# EAGLE design LM339rev3 (EAGLE 9.6.2)
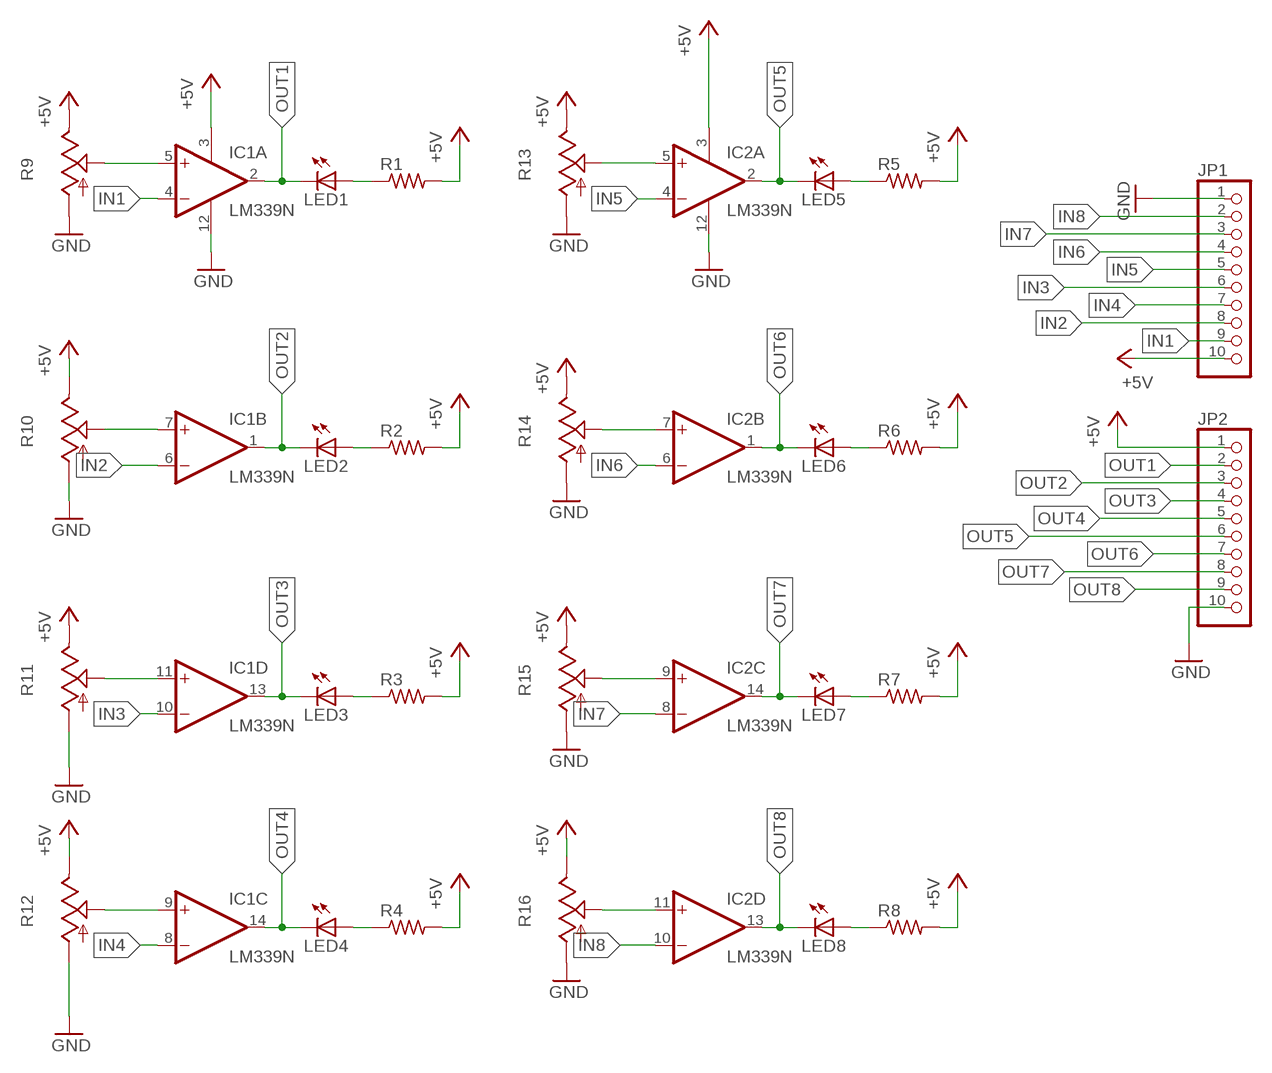
[diagram p0: schematic, sheet 1]

## Parts
IC1  LM339N  [DIL14]
IC2  LM339N  [DIL14]
JP1  PINHD-1X10  [1X10]
JP2  PINHD-1X10  [1X10]
LED1  LED5MM  [LED5MM]
LED2  LED5MM  [LED5MM]
LED3  LED5MM  [LED5MM]
LED4  LED5MM  [LED5MM]
LED5  LED5MM  [LED5MM]
LED6  LED5MM  [LED5MM]
LED7  LED5MM  [LED5MM]
LED8  LED5MM  [LED5MM]
R1  R-US_0204/7  [0204/7]
R2  R-US_0207/10  [0207/10]
R3  R-US_0204/7  [0204/7]
R4  R-US_0204/7  [0204/7]
R5  R-US_0204/7  [0204/7]
R6  R-US_0204/7  [0204/7]
R7  R-US_0207/10  [0207/10]
R8  R-US_0204/7  [0204/7]
R9  TRIM_US-CA6V  [CA6V]
R10  TRIM_US-CA6V  [CA6V]
R11  TRIM_US-CA6V  [CA6V]
R12  TRIM_US-CA6V  [CA6V]
R13  TRIM_US-CA6V  [CA6V]
R14  TRIM_US-CA6V  [CA6V]
R15  TRIM_US-CA6V  [CA6V]
R16  TRIM_US-CA6V  [CA6V]

## Nets
+5V: IC1.3(P:V+) IC2.3(P:V+) JP1.10 JP2.1 R1.2 R2.2 R3.2 R4.2 R5.2 R6.2 R7.2 R8.2 R9.E R10.E R11.E R12.E R13.E R14.E R15.E R16.E
GND: IC1.12(P:GND) IC2.12(P:GND) JP1.1 JP2.10 R9.A R10.A R11.A R12.A R13.A R14.A R15.A R16.A
IN1: IC1.4(A:-IN) JP1.9
IN2: IC1.6(B:-IN) JP1.8
IN3: IC1.10(D:-IN) JP1.6
IN4: IC1.8(C:-IN) JP1.7
IN5: IC2.4(A:-IN) JP1.5
IN6: IC2.6(B:-IN) JP1.4
IN7: IC2.8(C:-IN) JP1.3
IN8: IC2.10(D:-IN) JP1.2
N$1: LED2.A R2.1
N$2: LED1.A R1.1
N$3: LED3.A R3.1
N$4: LED4.A R4.1
N$5: LED5.A R5.1
N$6: LED6.A R6.1
N$7: LED7.A R7.1
N$8: LED8.A R8.1
N$9: IC1.11(D:+IN) R11.S
N$10: IC1.5(A:+IN) R9.S
N$11: IC1.7(B:+IN) R10.S
N$12: IC1.9(C:+IN) R12.S
N$13: IC2.9(C:+IN) R15.S
N$14: IC2.5(A:+IN) R13.S
N$15: IC2.7(B:+IN) R14.S
N$24: IC2.11(D:+IN) R16.S
OUT1: IC1.2(A:OUT) JP2.2 LED1.K(C)
OUT2: IC1.1(B:OUT) JP2.3 LED2.K(C)
OUT3: IC1.13(D:OUT) JP2.4 LED3.K(C)
OUT4: IC1.14(C:OUT) JP2.5 LED4.K(C)
OUT5: IC2.2(A:OUT) JP2.6 LED5.K(C)
OUT6: IC2.1(B:OUT) JP2.7 LED6.K(C)
OUT7: IC2.14(C:OUT) JP2.8 LED7.K(C)
OUT8: IC2.13(D:OUT) JP2.9 LED8.K(C)

## Library data of the parts
IC1 IC2 = linear:LM339: Low Power Low Offset Voltage Quad Comparators with open collector; LM139/LM239/LM339/LM2901/LM3302
JP1 JP2 = pinhead:PINHD-1X10: PIN HEADER
LED1-LED8 = led:LED: LED OSRAM: - CHIPLED LG R971, LG N971, LY N971, LG Q971, LY Q971, LO R971, LY R971 LH N974, LH R974 LS Q976, LO Q976, LY Q976 LO Q996 - Hyper CHIPLED LW Q18S LB Q993, LB Q99A, LB R99A - SideLED LS A670, LO A670, LY A670, LG A670, LP A670 LB A673, LV A673, LT A673, LW A673 LH A674 LY A675 LS A676, LA A676, LO A676, LY A676, LW A676 LS A679, LY A679, LG A679 - Hyper Micro SIDELED® LS Y876, LA Y876, LO Y876, LY Y876 LT Y87S - SmartLED LW L88C, LW L88S LB L89C, LB L89S, LG L890 LS L89K, LO L89K, LY L89K LS L896, LA L896, LO L896, LY L896 - TOPLED LS T670, LO T670, LY T670, LG T670, LP T670 LSG T670, LSP T670, LSY T670, LOP T670, LYG T670 LG T671, LOG T671, LSG T671 LB T673, LV T673, LT T673, LW T673 LH T674 LS T676, LA T676, LO T676, LY T676, LB T676, LH T676, LSB T676, LW T676 LB T67C, LV T67C, LT T67C, LS T67K, LO T67K, LY T67K, LW E67C LS E67B, LA E67B, LO E67B, LY E67B, LB E67C, LV E67C, LT E67C LW T67C LS T679, LY T679, LG T679 LS T770, LO T770, LY T770, LG T770, LP T770 LB T773, LV T773, LT T773, LW T773 LH T774 LS E675, LA E675, LY E675, LS T675 LS T776, LA T776, LO T776, LY T776, LB T776 LHGB T686 LT T68C, LB T68C - Hyper Mini TOPLED® LB M676 - Mini TOPLED Santana® LG M470 LS M47K, LO M47K, LY M47K Source: http://www.osram.convergy.de LUXEON: - LUMILED® LXK2-PW12-R00, LXK2-PW12-S00, LXK2-PW14-U00, LXK2-PW14-V00 LXK2-PM12-R00, LXK2-PM12-S00, LXK2-PM14-U00 LXK2-PE12-Q00, LXK2-PE12-R00, LXK2-PE12-S00, LXK2-PE14-T00, LXK2-PE14-U00 LXK2-PB12-K00, LXK2-PB12-L00, LXK2-PB12-M00, LXK2-PB14-N00, LXK2-PB14-P00, LXK2-PB14-Q00 LXK2-PR12-L00, LXK2-PR12-M00, LXK2-PR14-Q00, LXK2-PR14-R00 LXK2-PD12-Q00, LXK2-PD12-R00, LXK2-PD12-S00 LXK2-PH12-R00, LXK2-PH12-S00 LXK2-PL12-P00, LXK2-PL12-Q00, LXK2-PL12-R00 Source: www.luxeon.com KINGBRIGHT: KA-3528ASYC Source: www.kingbright.com
R1-R8 = rcl:R-US_: RESISTOR, American symbol; SPICEPREFIX: R
R9-R16 = pot:TRIM_US-: POTENTIOMETER

## Board
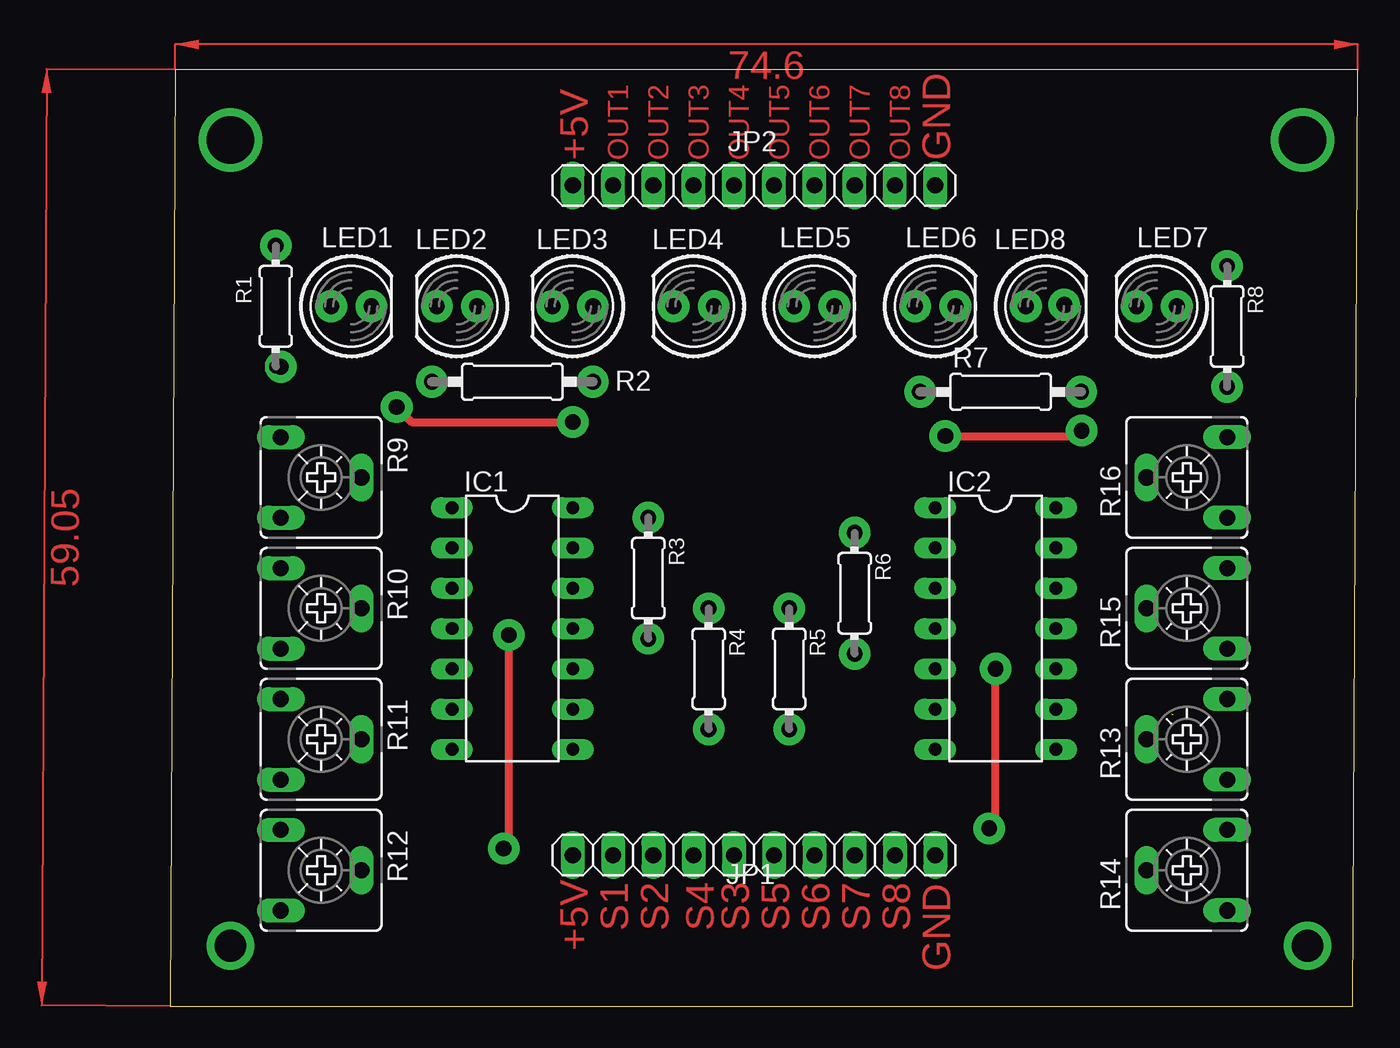
[diagram p1: board, top side]
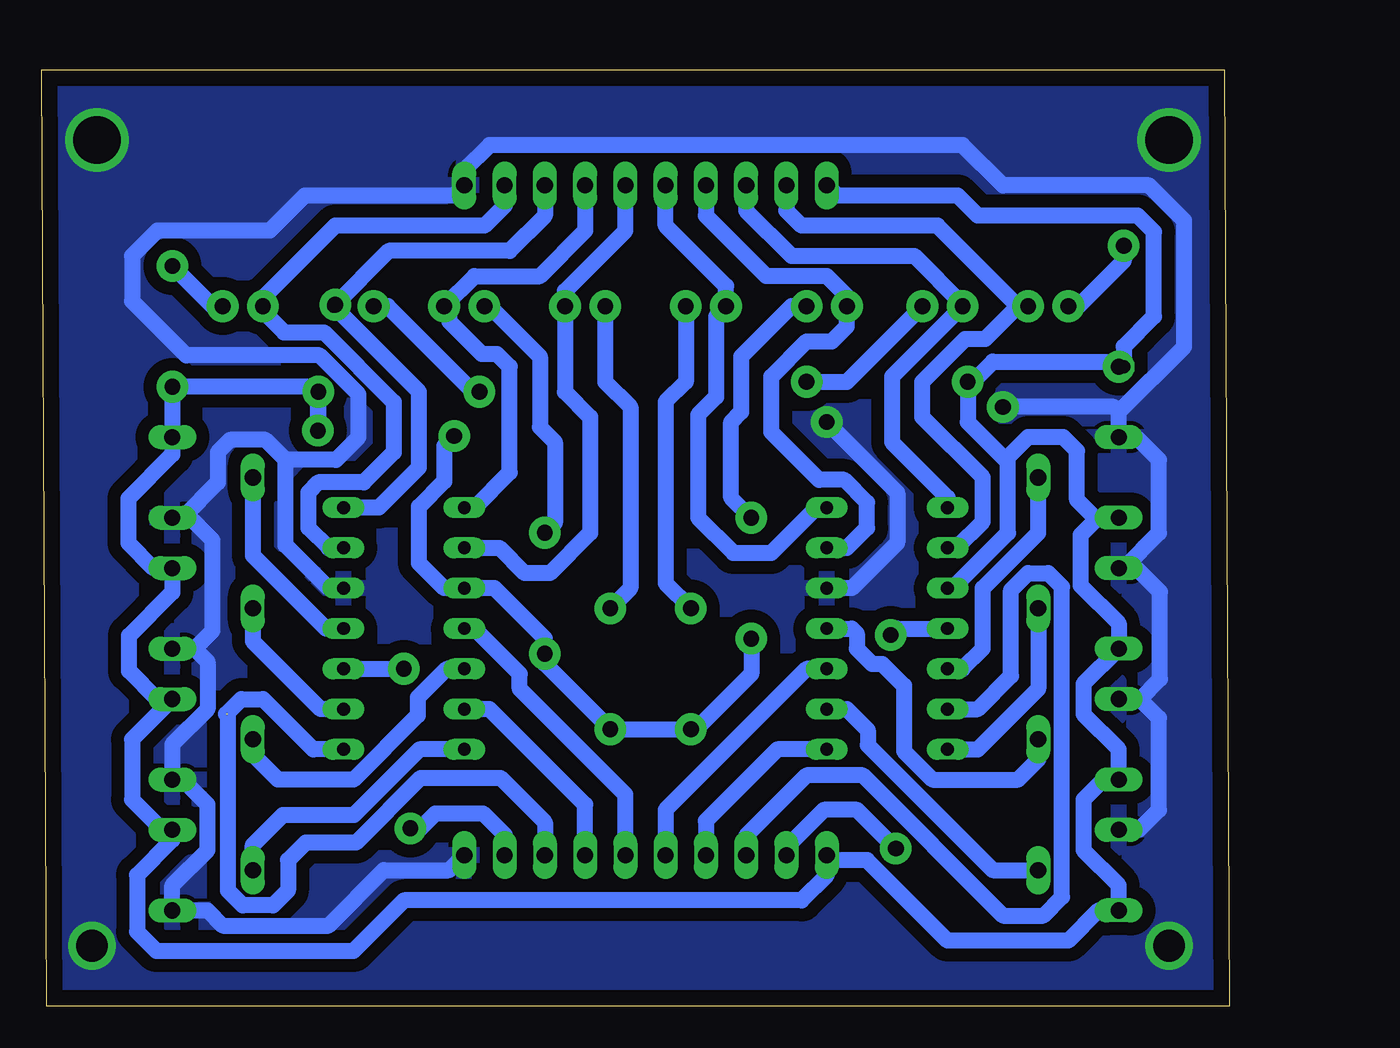
[diagram p2: board, bottom side, seen from below]

Size 74.92 x 59.05 mm. Coordinates in mm from the lower left corner, seen from the top.
Outline: 0,0 74.6,0 74.92,59.05 0.32,59.05 0,0
Copper layers (1*16): Top 0.035mm / dielectric 1.5mm / Bottom 0.035mm
Design rules "default": minimum track width 6mil, minimum drill 0.35mm, track to track 6mil, track to pad 6mil, pad to pad 6mil, via to via 6mil, smd to smd 6mil, copper to edge 40mil, drill to drill 6mil, minimum pad ring 10mil, minimum via ring 8mil, stop-mask expansion 4mil, vias tented up to drill 0mil, thermal gap 10mil

### Footprints (pad centres in the part's own frame; a part is rotated, then mirrored left to right if it is on the bottom)
DIL14 = drill 0.813 long: 1 -7.62,-3.81; 2 -5.08,-3.81; 3 -2.54,-3.81; 4 0,-3.81; 5 2.54,-3.81; 6 5.08,-3.81; 7 7.62,-3.81; 8 7.62,3.81; 9 5.08,3.81; 10 2.54,3.81; 11 0,3.81; 12 -2.54,3.81; 13 -5.08,3.81; 14 -7.62,3.81
1X10 = drill 1.016 long: 1 -11.43,0; 2 -8.89,0; 3 -6.35,0; 4 -3.81,0; 5 -1.27,0; 6 1.27,0; 7 3.81,0; 8 6.35,0; 9 8.89,0; 10 11.43,0
LED5MM = drill 0.813 octagon: A -1.27,0; K 1.27,0
0204/7 = drill 0.813 octagon: 1 -3.81,0; 2 3.81,0
0207/10 = drill 0.813 octagon: 1 -5.08,0; 2 5.08,0
CA6V = drill 1.016 long: A -2.54,-2.54; E 2.54,-2.54; S 0,2.54

### Placement (x,y rotation side)
IC1  21.59,23.81 270 top
IC2  52.07,23.81 270 top
JP1  36.83,9.53 180 top
JP2  36.83,51.75 0 top
LED1  11.43,44.13 0 top
LED2  18.1,44.13 180 top
LED3  25.4,44.13 180 top
LED4  33.02,44.13 180 top
LED5  40.64,44.13 0 top
LED6  48.26,44.13 0 top
LED7  55.24,44.13 0 top
LED8  62.23,44.13 180 top
R1  6.67,44.13 270 top
R2  21.59,39.37 180 top
R3  30.16,26.99 270 top
R4  33.97,21.27 270 top
R5  39.05,21.27 270 top
R6  43.18,26.04 270 top
R7  52.39,38.73 0 top
R8  66.68,42.86 270 top
R9  9.53,33.34 270 top
R10  9.53,25.08 270 top
R11  9.53,16.83 270 top
R12  9.53,8.57 270 top
R13  64.14,16.83 90 top
R14  64.14,8.57 90 top
R15  64.14,25.08 90 top
R16  64.14,33.34 90 top

### Tracks (layer width: path | path; a pad name or v marks a point on that pad's centre or on a via)
+5V  (via drill 1 pad 2)
  Top 0.508: v48.89,35.95 57.15,35.95 v57.49,36.29
  Top 1.016: v57.49,36.29 57.47,36.27
  Bottom 1.016: R10.E 6.74,22.54 | R10.E 6.98,24.13 9.39,26.54 9.39,29.7 8.3,30.8 R9.E 8.48,30.8 9.61,31.92 9.61,35.01 10.48,35.88 12.7,35.88 13.97,34.61 | 17.15,26.35 IC1.3 17.46,26.35 13.97,29.84 13.97,34.61 | JP2.1 24.77,51.12 17.15,51.12 15.88,49.85 5.79,49.85 4.76,48.82 4.76,43.5 6.67,41.59 R1.2 6.98,40.64 14.92,40.64 16.19,39.37 v16.51,39.37 16.51,36.83 14.13,34.45 13.97,34.61 | R3.2 30.16,20.95 33.66,17.46 R4.2 R5.2 43.18,21.59 R6.2 43.18,23.18 46.35,26.35 IC2.3 49.53,26.35 51.12,27.94 51.12,31.5 49.53,33.09 49.53,35.31 v48.89,35.95 | 25.4,9.21 25.4,8.25 26.99,6.67 52.07,6.67 55.24,3.49 67.69,3.49 68.9,4.7 68.9,8.25 66.68,10.48 R14.E 67.31,11.11 69.22,13.02 69.22,16.83 R13.E 67.63,19.37 69.4,21.14 69.4,23.36 66.68,26.09 R15.E 67.87,27.62 69.46,29.21 69.46,32.01 66.68,34.8 R16.E R8.2 58.1,39.05 57.49,38.45 v57.49,36.29 57.47,36.32 R7.2 | 25.4,9.21 JP1.10 | 25.4,9.21 22.86,9.21 17.78,4.13 10.16,4.13 8.26,6.03 R12.E 6.98,7.62 9.21,9.84 9.21,13.02 7.94,14.29 R11.E 6.98,16.19 9.21,18.41 9.21,20.32 R10.E
GND  (via drill 1 pad 2, 2 pad 3, 3 pad 4)
  Top 0.508: v14.29,37.78 15.24,36.83 v25.4,36.83
  Bottom 1.016: R15.A 65.28,22.54 | 65.28,22.54 64.14,23.68 64.14,29.37 65.56,30.8 R16.A 66.04,30.8 63.82,33.02 63.82,34.92 63.03,35.71 60.79,35.71 59.54,34.45 | 56.52,26.35 IC2.12 56.83,26.35 59.54,29.06 59.54,34.45 | 6.98,37.46 R9.A 5.87,35.88 4.45,34.45 4.45,29.84 6.67,27.62 R10.A 5.87,27.62 4.38,26.13 4.38,20.64 5.65,19.37 | 6.98,37.46 7.3,37.78 v14.29,37.78 | v25.4,36.83 20.96,32.38 20.96,29.21 23.81,26.35 IC1.12 | 6.98,37.46 2.86,41.59 2.86,49.53 5.08,51.75 14.29,51.75 16.83,54.29 46.67,54.29 48.26,52.7 JP2.10 48.89,51.12 58.3,51.12 60.53,48.89 67.63,48.89 69.22,47.31 69.22,44.45 65.8,41.03 57.39,41.03 54.93,38.57 54.93,35.88 56.36,34.45 59.53,34.45 59.54,34.45 | R11.A 5.65,19.37 | R12.A 5.71,11.11 4.45,12.38 4.45,18.16 5.65,19.37 | 65.28,22.54 64.45,21.72 64.45,18.73 66.68,16.51 R13.A 66.04,14.29 64.45,12.7 64.45,9.84 66.68,7.62 R14.A 64.45,6.03 63.5,5.08 56.83,5.08 53.34,8.57 49.21,8.57 JP1.1
  other vias: 71.76,3.81 3.81,3.81 3.81,54.61 71.44,54.61
  pour Bottom (isolate 0.813): -2.54,60.01 -2.54,-1.59 77.15,-1.59 77.15,60.01
IN1  (via drill 1 pad 2)
  Top 0.508: v21.05,9.94 21.37,10.26 v21.37,23.4
  Bottom 1.016: v21.37,23.4 20.96,23.81 IC1.4 | JP1.9 27.94,10.03 25.59,12.38 23.49,12.38 v21.05,9.94
IN2
  Bottom 1.016: JP1.8 30.48,10.74 26.66,14.55 23.13,14.55 14.29,5.71 11.75,5.71 10.56,6.9 10.56,26.44 11.43,27.3 12.7,27.3 13.78,26.23 13.78,20.83 15.88,18.73 IC1.6
IN3
  Bottom 1.016: JP1.6 35.56,12.38 26.67,21.27 IC1.10 25.66,21.27
IN4
  Bottom 1.016: IC1.8 28.52,16.19 33.02,11.69 JP1.7
IN5
  Bottom 1.016: IC2.4 47.62,23.81 44.77,20.95 44.77,20 38.1,13.34 JP1.5
IN6
  Bottom 1.016: 40.64,8.89 JP1.4 40.64,12.7 46.67,18.73 IC2.6
IN7  (1 unrouted)
  Bottom 1.016: JP1.3 43.18,11.59 45.99,14.39 51.01,14.39 55.09,10.32 58.26,10.32 59.37,9.21 59.37,7.3 60.32,6.35 62.23,6.35 63.18,7.3 63.18,18.41 | IC2.8 57.78,16.19 60.96,19.37 62.33,19.37 63.28,18.41
IN8  (via drill 1 pad 2)
  Top 0.508: v51.66,11.21 52.07,11.21 v52.07,21.27
  Bottom 1.016: 56.52,21.27 IC2.10 v52.07,21.27 | v51.66,11.21 51.03,11.21 50.07,12.16 47.09,12.16 45.72,10.8 JP1.2
N$1
  Bottom 1.016: R2.1 24.13,39.37 LED2.A
N$2
  Bottom 1.016: LED1.A 9.53,44.13 6.67,46.99 R1.1
N$3
  Bottom 1.016: LED3.A 27.62,44.13 30.8,40.96 30.8,37.46 31.43,36.83 31.43,32.07 R3.1
N$4
  Bottom 1.016: LED4.A 34.29,39.37 35.56,38.1 35.56,26.67 R4.1
N$5
  Bottom 1.016: LED5.A 39.37,39.37 37.78,37.78 37.78,26.35 R5.1
N$6
  Bottom 1.016: R6.1 42.54,30.48 42.54,35.56 43.5,36.51 43.5,40.96 46.67,44.13 LED6.A
N$7
  Bottom 1.016: 47.62,38.73 R7.1 47.5,38.54 53.09,44.13 LED7.A
N$8
  Bottom 1.016: R8.1 64.14,44.13 LED8.A
N$9
  Bottom 1.016: R11.S 12.06,15.56 13.33,14.29 18.73,14.29 20.52,16.08 20.52,20.2 21.91,21.59 22.54,21.59 23.5,22.54 23.5,23.49 23.81,23.81 IC1.11
N$10
  Bottom 1.016: R9.S 12.06,29.84 15.56,26.35 15.56,22.54 16.83,21.27 IC1.5
N$11
  Bottom 1.016: R10.S 12.06,20 15.88,16.19 IC1.7
N$12
  Bottom 1.016: 25.08,18.73 IC1.9 24.13,18.73 22.8,17.41 22.8,16.45 14.92,8.57 R12.S
N$13
  Bottom 1.016: IC2.9 57.31,18.73 61.59,23.02 R15.S
N$14
  Bottom 1.016: IC2.5 49.37,21.27 51.2,19.45 51.2,18.34 55.24,14.29 60.01,14.29 61.59,15.88 R13.S
N$15
  Bottom 1.016: IC2.7 51.09,16.19 55.22,12.07 59.69,12.07 61.59,10.16 R14.S
N$16  (via drill 1 pad 2)
  other vias: 6.67,47.94
N$17  (via drill 1 pad 2)
  other vias: 6.98,40.32
N$18  (via drill 1 pad 2)
  other vias: 12.7,44.13
N$19  (via drill 1 pad 2)
  other vias: 24.13,44.13
N$20  (via drill 1 pad 2)
  other vias: 26.67,44.13
N$21  (via drill 1 pad 2)
  other vias: 31.75,44.13
N$22  (via drill 1 pad 2)
  other vias: 43.18,29.84
N$23  (via drill 1 pad 2)
  other vias: 34.29,44.13
N$24
  Bottom 1.016: R16.S 61.59,28.43 56.98,23.81 IC2.11
N$25  (via drill 1 pad 2)
  other vias: 39.37,44.13
N$26  (via drill 1 pad 2)
  other vias: 41.91,44.13
N$27  (via drill 1 pad 2)
  other vias: 26.67,39.37
N$28  (via drill 1 pad 2)
  other vias: 49.53,44.13
N$29  (via drill 1 pad 2)
  other vias: 53.98,44.13
N$30  (via drill 1 pad 2)
  other vias: 56.4,44.23
N$31  (via drill 1 pad 2)
  other vias: 47.31,38.73
N$32  (via drill 1 pad 2)
  other vias: 57.47,38.73
N$33  (via drill 1 pad 2)
  other vias: 66.68,39.05
N$34  (via drill 1 pad 2)
  other vias: 63.5,44.13
N$35  (via drill 1 pad 2)
  other vias: 66.68,46.67
N$36  (via drill 1 pad 2)
  other vias: 60.96,44.13
N$37  (via drill 1 pad 2)
  other vias: 10.16,44.13
N$38  (via drill 1 pad 2)
  other vias: 33.97,17.46
N$39  (via drill 1 pad 2)
  other vias: 39.05,17.46
N$40  (via drill 1 pad 2)
  other vias: 43.18,22.22
N$41  (via drill 1 pad 2)
  other vias: 19.37,44.13
N$42  (via drill 1 pad 2)
  other vias: 16.83,44.13
N$43  (via drill 1 pad 2)
  other vias: 33.97,25.08
N$44  (via drill 1 pad 2)
  other vias: 30.16,30.8
N$45  (via drill 1 pad 2)
  other vias: 30.16,23.18
N$46  (via drill 1 pad 2)
  other vias: 39.05,25.08
N$47  (via drill 1 pad 2)
  other vias: 46.99,44.13
OUT1
  Bottom 1.016: IC1.2 17.22,28.89 15.56,30.55 15.56,33.34 19.37,37.15 19.37,39.37 16.67,42.07 15.4,42.07 13.33,44.13 | JP2.2 27.94,50.16 26.99,49.21 18.42,49.21 13.33,44.13 | LED1.K 13.33,44.13
OUT2
  Bottom 1.016: JP2.3 30.48,50.16 27.62,47.31 19.87,47.31 16.83,44.26 LED2.K 21.27,39.69 21.27,35.56 17.78,32.07 IC1.1
OUT3
  Bottom 1.016: JP2.4 33.02,49.85 29.21,46.04 25.4,46.04 24.13,44.77 LED3.K 24.13,42.86 25.08,41.91 26.67,41.91 28.89,39.69 28.89,36.2 25.88,33.18 24.29,33.18 22.86,31.75 22.86,30.16 24.13,28.89 IC1.13
OUT4
  Bottom 1.016: JP2.5 35.56,49.21 31.75,45.4 LED4.K 32.38,43.5 32.38,38.42 33.52,37.29 33.52,30.8 31.29,28.57 28.89,28.57 26.04,31.43 IC1.14
OUT5
  Bottom 1.016: 47.56,28.89 IC2.2 46.04,28.89 44.45,27.3 42.86,27.3 40.32,29.84 40.32,37.15 41.91,38.73 LED5.K 41.91,45.09 38.1,48.89 JP2.6
OUT6
  Bottom 1.016: JP2.7 40.64,48.89 43.5,46.04 47.62,46.04 LED6.K 49.21,43.81 49.21,43.18 47.15,41.12 46.2,41.12 45.4,40.32 45.4,33.66 47.62,31.43 IC2.1
OUT7
  Bottom 1.016: JP2.8 43.18,49.85 45.4,47.62 53.02,47.62 LED7.K 51.12,38.73 51.12,33.97 53.66,31.43 IC2.14
OUT8
  Bottom 1.016: JP2.9 45.72,50.48 46.99,49.21 56.4,49.21 60.96,44.65 LED8.K 60.96,43.81 59.62,42.48 57.1,42.48 52.7,38.08 52.7,34.92 54.61,33.02 57.47,33.02 58.1,32.38 58.1,30.16 56.83,28.89 IC2.13
(copper drawn outside any net)
  shapes: Top area x2

### Text on the board
Top: +5V | OUT1 | OUT2 | OUT3 | OUT4 | OUT5 | OUT6 | OUT7 | OUT8 | GND | S1 | S2 | S4 | S3 | S5 | S6 | S7 | S8 | +5V | GND